# Altium schematic sheet Encoder.SchDoc
size A
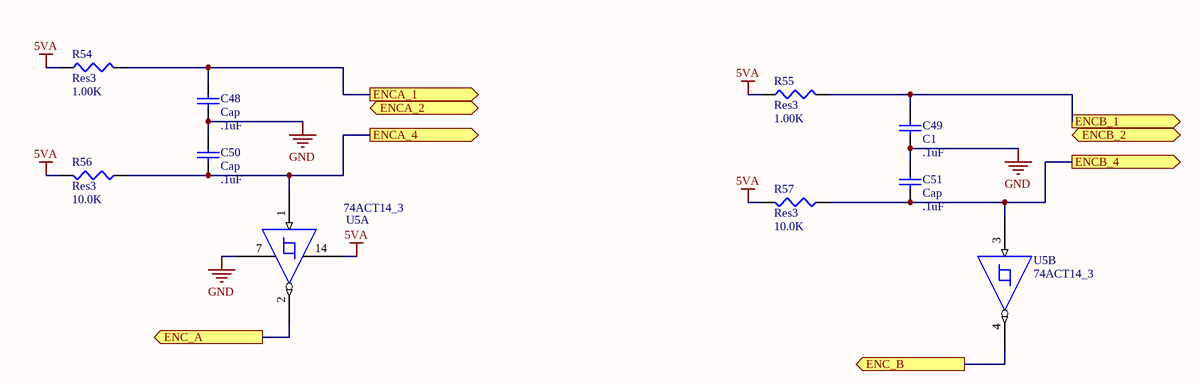
[diagram p0: Encoder.SchDoc]

## Parts
C48  Cap  value .1uF  [CAPC2012X09M]
C49  C1  value .1uF  [CAPC2012X09M]
C50  Cap  value .1uF  [CAPC2012X09M]
C51  Cap  value .1uF  [CAPC2012X09M]
R54  Res3  value 1.00K  [RESC2112X05M]
R55  Res3  value 1.00K  [RESC2112X05M]
R56  Res3  value 10.0K  [RESC2112X05M]
R57  Res3  value 10.0K  [RESC2112X05M]
U5  74ACT14_3  [SOIC127P600X175-14M]  (parts A,B of 6)

## Ports
ENC_A (out), ENC_B (out), ENCA_1 (out), ENCA_2 (out), ENCA_4 (out), ENCB_1 (out), ENCB_2 (out), ENCB_4 (out)

## Nets
5VA: R54.1 R55.1 R56.2 R57.2 U5.14(VCC)
GND: C48.1 C49.1 C50.2 C51.2 U5.7(GND_POWER)
ENC_A: U5.2(Y) ; port ENC_A
ENC_B: U5.4(Y) ; port ENC_B
ENCA_1: C48.2 R54.2 ; port ENCA_1
ENCA_4: C50.1 R56.1 U5.1(A) ; port ENCA_4
ENCB_1: C49.2 R55.2 ; port ENCB_1
ENCB_4: C51.1 R57.1 U5.3(A) ; port ENCB_4

## Library data of the parts
C48-C51 = CAP-X7R-.1uF-16V-±10%: CAP CER .1uF 16v X7R 0805; MPN: C0805C104K4RACTU; PN: 399-1167-1-ND; Name: CAP-X7R-.1uF-16V-±10%; URL: http://www.digikey.ca/product-detail/en/C0805C104K4RACTU/399-1167-1-ND
R54 R55 = Resistor_1.00K: RES SMD 1.00K OHM 1% 1/8W 0805; MPN: CRCW08051K00FKEA; PN: 541-1.00KCCT-ND; Name: Resistor_1.00K; URL: http://www.digikey.ca/product-detail/en/CRCW08051K00FKEA/541-1.00KCCT-ND
R56 R57 = Resistor_10.0K: RES SMD 10.0K OHM 1% 1/8W 0805; MPN: CRCW080510K0FKEA; PN: 541-10.0KCCT-ND; Name: Resistor_10.0K; URL: http://www.digikey.ca/product-detail/en/CRCW080510K0FKEA/541-10.0KCCT-ND
U5 = 74ACT14_3: IC INVERTER HEX SCHMITT 14SOIC; MPN: 74ACT14SCX; PN: 74ACT14SCXCT-ND; URL: http://www.digikey.ca/product-detail/en/74ACT14SCX/74ACT14SCXCT-ND